# Altium schematic sheet DisplayPort.SchDoc
size A3
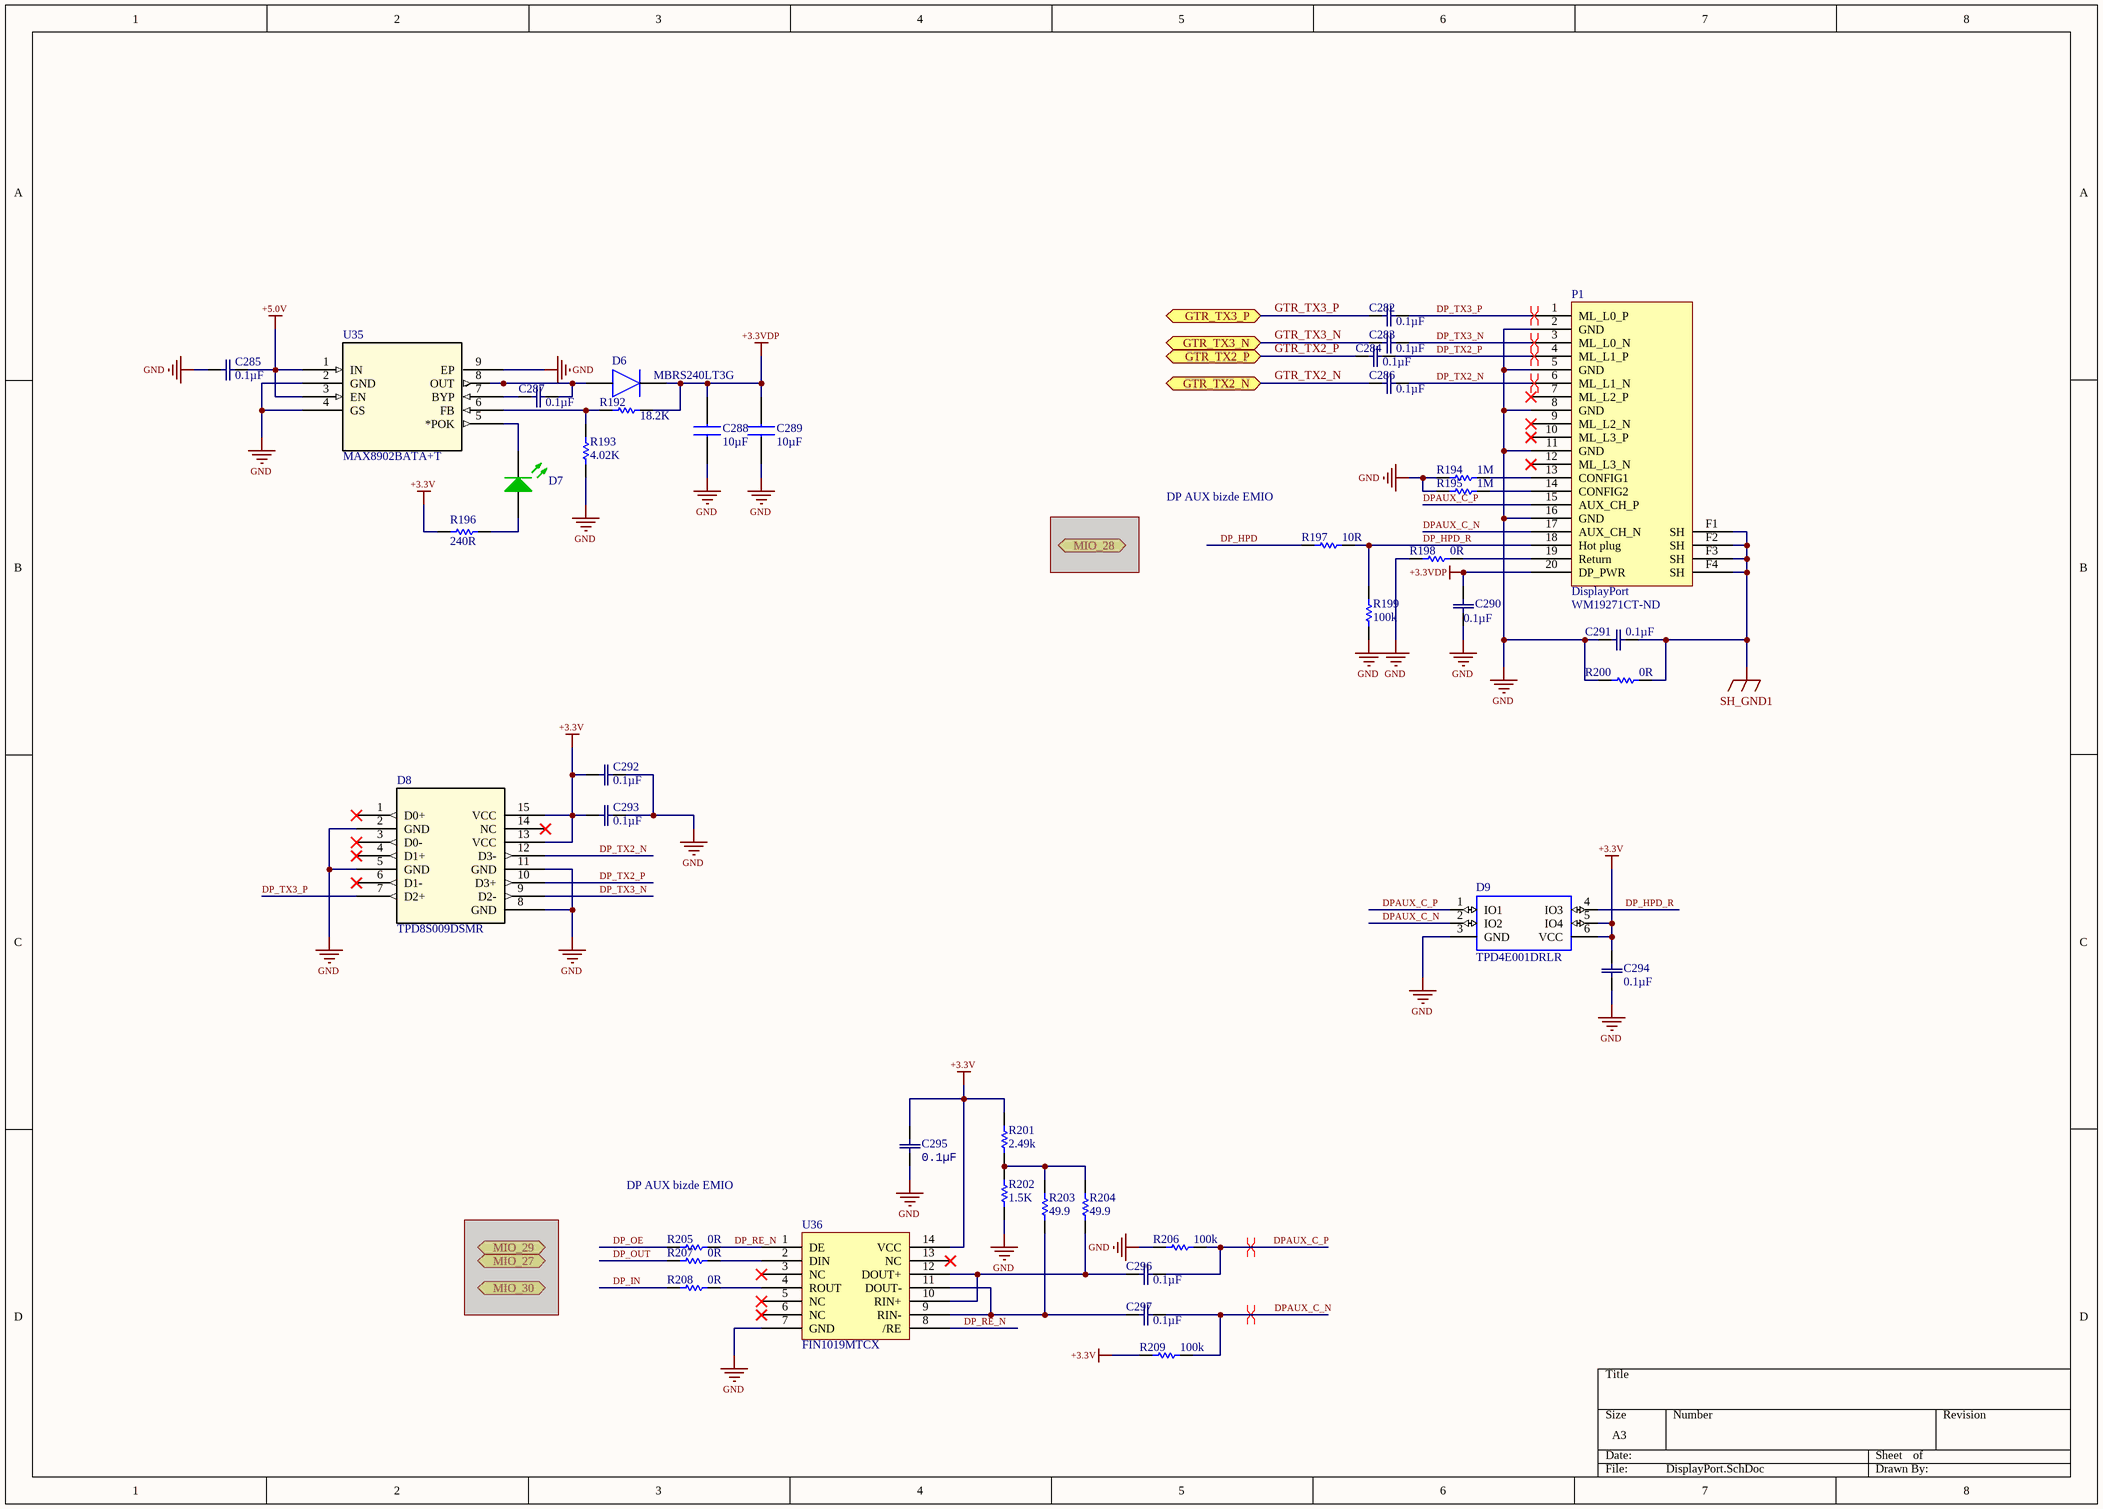
[diagram p0: DisplayPort.SchDoc]

## Parts
C282  value 0.1µF  [CAP_0603]  (hidden comment: C0603X5R1E104K030BB)
C283  value 0.1µF  [CAP_0603]  (hidden comment: C0603X5R1E104K030BB)
C284  value 0.1µF  [CAP_0603]  (hidden comment: C0603X5R1E104K030BB)
C285  value 0.1µF  [CAP_0603]  (hidden comment: C0603X5R1E104K030BB)
C286  value 0.1µF  [CAP_0603]  (hidden comment: C0603X5R1E104K030BB)
C287  value 0.1µF  [CAP_0603]  (hidden comment: C0603X5R1E104K030BB)
C288  value 10µF  [CAP 0402ZD106]  (hidden comment: 0402ZD106MAT2A)
C289  value 10µF  [CAP 0402ZD106]  (hidden comment: 0402ZD106MAT2A)
C290  value 0.1µF  [CAP_0603]  (hidden comment: C0603X5R1E104K030BB)
C291  value 0.1µF  [CAP_0603]  (hidden comment: C0603X5R1E104K030BB)
C292  value 0.1µF  [CAP_0603]  (hidden comment: C0603X5R1E104K030BB)
C293  value 0.1µF  [CAP_0603]  (hidden comment: C0603X5R1E104K030BB)
C294  value 0.1µF  [CAP_0603]  (hidden comment: C0603X5R1E104K030BB)
C295  value 0.1µF  [CAP_0603]  (hidden comment: C0603X5R1E104K030BB)
C296  value 0.1µF  [CAP_0603]  (hidden comment: C0603X5R1E104K030BB)
C297  value 0.1µF  [CAP_0603]  (hidden comment: C0603X5R1E104K030BB)
D6  MBRS240LT3G  [DIOM5436X247N]
D7  LED0603GREEN  [LED0603GREEN]  (value not drawn)
D8  TPD8S009DSMR  [DSM15]
D9  TPD4E001DRLR  [SOTFL50P160X60-6N]
P1  DisplayPort  Supplier Part Number 1: WM19271CT-ND  [8470-2-2-X]
R192  value 18.2K  [RES_CRCW_0402]  (hidden comment: RES0402_18K2)
R193  value 4.02K  [RC0402N]  (hidden comment: RES0402_4K02)
R194  value 1M  [RESC1005L_0402]  (hidden comment: RES0402_1M)
R195  value 1M  [RESC1005L_0402]  (hidden comment: RES0402_1M)
R196  value 240R  [RESC1005L_0402]  (hidden comment: RES0402_240R_0W1_1T)
R197  value 10R  [RESC1005L_0402]  (hidden comment: RES0402_10R)
R198  value 0R  [RESC1005L_0402]  (hidden comment: RES0402_0R)
R199  value 100k  [RESC1005L_0402]  (hidden comment: RES0402_100K_0W2_1T)
R200  value 0R  [RESC1005L_0402]  (hidden comment: RES0402_0R_0W1)
R201  value 2.49k  [RESC1005L_0402]  (hidden comment: RES0402_2K49_0W1_1T)
R202  value 1.5K  [RESC1005L_0402]  (hidden comment: RES0402_1K5)
R203  value 49.9  [RESC1005L_0402]  (hidden comment: RES0402_49.9)
R204  value 49.9  [RESC1005L_0402]  (hidden comment: RES0402_49.9)
R205  value 0R  [RESC1005L_0402]  (hidden comment: RES0402_0R)
R206  value 100k  [RESC1005L_0402]  (hidden comment: RES0402_100K_0W2_1T)
R207  value 0R  [RESC1005L_0402]  (hidden comment: RES0402_0R)
R208  value 0R  [RESC1005L_0402]  (hidden comment: RES0402_0R)
R209  value 100k  [RESC1005L_0402]  (hidden comment: RES0402_100K_0W2_1T)
U35  MAX8902BATA+T  [21-0168E_T822-1]
U36  FIN1019MTCX  [TSOP65P640X120-14N]

## Ports
GTR_TX2_N, GTR_TX2_P, GTR_TX3_N, GTR_TX3_P, MIO_27, MIO_28, MIO_29, MIO_30

## Nets
+3.3V: C292.2 C293.2 C294.2 C295.2 D8.13(VCC) D8.15(VCC) D9.5(IO4) D9.6(VCC) R196.1 R201.2 R209.1 U36.14(VCC)
+3.3VDP: C288.2 C289.2 C290.2 D6.1(K) P1.20(DP_PWR) R192.2
+5.0V: C285.2 U35.1(IN) U35.3(EN)
GND: C285.1 C288.1 C289.1 C290.1 C291.1 C292.1 C293.1 C294.1 C295.1 D8.2(GND) D8.5(GND) D8.8(GND) D8.11(GND) D9.3(GND) P1.2(GND) P1.5(GND) P1.8(GND) P1.11(GND) P1.16(GND) R193.1 R194.1 R195.1 R198.1 R199.1 R200.1 R202.1 R206.1 U35.2(GND) U35.4(GS) U35.9(EP) U36.7(GND)
SH_GND1: C291.2 P1.F1(SH) P1.F2(SH) P1.F3(SH) P1.F4(SH) R200.2
DP_HPD: R197.1
DP_HPD_R: D9.4(IO3) P1.18(Hot_plug) R197.2 R199.2
DP_IN: R208.1
DP_OE: R205.1
DP_OUT: R207.1
DP_RE_N: R205.2 U36.1(DE) U36.8(/RE)
DP_TX2_N: C286.2 D8.12(D3-) P1.6(ML_L1_N)
DP_TX2_P: C284.2 D8.10(D3+) P1.4(ML_L1_P)
DP_TX3_N: C283.2 D8.9(D2-) P1.3(ML_L0_N)
DP_TX3_P: C282.2 D8.7(D2+) P1.1(ML_L0_P)
DPAUX_C_N: C297.2 D9.2(IO2) P1.17(AUX_CH_N) R209.2
DPAUX_C_P: C296.2 D9.1(IO1) P1.15(AUX_CH_P) R206.2
GTR_TX2_N: C286.1 ; port GTR_TX2_N
GTR_TX2_P: C284.1 ; port GTR_TX2_P
GTR_TX3_N: C283.1 ; port GTR_TX3_N
GTR_TX3_P: C282.1 ; port GTR_TX3_P
NetC287_1: C287.1 U35.7(BYP)
NetC287_2: C287.2 D6.2(A) U35.8(OUT)
NetC296_1: C296.1 R204.1 U36.10(RIN+) U36.12(DOUT+)
NetC297_1: C297.1 R203.1 U36.9(RIN-) U36.11(DOUT-)
NetD7_1: D7.1(A) R196.2
NetD7_2: D7.2(K) U35.5(*POK)
NetP1_13: P1.13(CONFIG1) R194.2
NetP1_14: P1.14(CONFIG2) R195.2
NetP1_19: P1.19(Return) R198.2
NetR192_1: R192.1 R193.2 U35.6(FB)
NetR201_1: R201.1 R202.2 R203.2 R204.2
NetR207_2: R207.2 U36.2(DIN)
NetR208_2: R208.2 U36.4(ROUT)

Not connected (* = marked no-connect by the designer): D8 1(D0+)* 3(D0-)* 4(D1+)* 6(D1-)* 14(NC)*; P1 7(ML_L2_P)* 9(ML_L2_N)* 10(ML_L3_P)* 12(ML_L3_N)*; U36 3(NC)* 5(NC)* 6(NC)* 13(NC)*

## Layout directives
differential pair: DP_TX2_N, DP_TX2_P, DP_TX3_N, DP_TX3_P, DPAUX_C_N, DPAUX_C_P

## Notes on the sheet
- DP AUX bizde EMIO

## Library data of the parts
C282-C287 C290-C297 = C0603X5R1E104K030BB: CAP CER 0.1UF 25V 10% X5R 0201; Manufacturer: TDK Corporation; Detailed Description: 0.1µF ±10% 25V Ceramic Capacitor X5R 0201 (0603 Metric); Manufacturer_Part_Number: C0603X5R1E104K030BB; Digi-Key Part Number: 445-13671-1-ND; Tolerance: ±10%; Voltage - Rated: 25V; Temperature Coefficient: X5R; Operating Temperature: -55°C ~ 85°C; Features: Low ESL; Applications: General Purpose; Mounting Type: Surface Mount, MLCC; Supplier 1: Digi-Key; Supplier Part Number 1: 445-13671-1-ND
C288 C289 = CAP 0402ZD106: CAP CER 10UF 10V X5R 0402; Manufacturer_Name: AVX; Geometry.Height: 0.56mm; Detailed Description: 10µF ±20% 10V Ceramic Capacitor X5R 0402 (1005 Metric); Tolerance: ±20%; Manufacturer_Part_Number: 0402ZD106MAT2A; Datasheet Link: http://www.mouser.com/catalog/supplier/library/pdf/AVXSurfaceMountCeramic.pdf; Digi-Key Part Number: 478-10052-1-ND; Voltage - Rated: 10V; Temperature Coefficient: X5R; Operating Temperature: -55°C ~ 85°C; Mounting Type: Surface Mount, MLCC; Supplier 1: Digi-Key; Supplier Part Number 1: 478-10052-2-ND
D6 = D MBRS240LT3G: DIODE SCHOTTKY 40V 2A SMB; Manufacturer_Name: ON Semiconductor; Allied_Number: 70099506; Geometry.Height: 2.47mm; Supplier_Name: RS; RS Part Number: 1022262; Manufacturer_Part_Number: MBRS240LT3G; Other Part Number: *; Datasheet Link: http://www.onsemi.com/pub/Collateral/MBRS240LT3-D.PDF; 3D Package: *; Supplier 1: Digi-Key; Supplier Part Number 1: MBRS240LT3GOSCT-ND
D7 = LED0603GREEN: LED GREEN DIFFUSED 0603 SMD; Manufacturer 1: Broadcom Limited; Manufacturer Part Number 1: HSMM-C190; Voltage - Forward (Vf) (Typ): 3.3V; Current - Test: 20mA; Package: 0603; Supplier 1: Digi-Key; Supplier Part Number 1: 516-2833-1-ND; ComponentLink1Description: Datasheet; ComponentLink1URL: C:\Users\Public\Documents\Altium\AD16\Library\PDF\AV02-0592EN0.pdf
D8 = TPD8S009DSMR: TVS DIODE 5.5VWM 15SON; Vendor: Texas Instruments; Section: Power Management; C: Copyright (C) 2015 Accelerated Designs. All rights reserved; Manufacturer_Part_Number: TPD8S009DSMR; Family: Power Misc; Manufacturer_Name: Texas Instruments; Copyright: Copyright (C) 2015 Accelerated Designs. All rights reserved; RS_Part_Number: 7099082; Value: Value; Type: Type; RefDes: RefDes; Supplier 1: Digi-Key; Supplier Part Number 1: 296-23829-1-ND
D9 = D TPD4E001DRLR: Low-Capacitance 4-Channel +/-15-kV ESD Protection Array for High-Speed Data Interfaces; Manufacturer_Name: Texas Instruments; Geometry.Height: 0.6mm; Type: Steering; Unidirectional Channels: 4; Voltage - Reverse Standoff (Typ): 5.5V (Max); Voltage - Breakdown (Min): 11V; Power - Peak Pulse: 100W; Power Line Protection: Yes; Manufacturer_Part_Number: TPD4E001DRLR; Datasheet Link: http://www.ti.com/lit/ds/symlink/tpd4e001.pdf; Digi-Key Part Number: 296-21887-1-ND; Applications: Ethernet; Operating Temperature: -40°C ~ 85°C (TA); Mounting Type: Surface Mount; Package / Case: SOT-563, SOT-666; Supplier Device Package: 6-SOT; Supplier 1: Digi-Key; Supplier Part Number 1: 296-21887-1-ND
P1 = DisplayPort: CONN RCPT 20POS UDI R/A SMD; Manufacturer: Molex, LLC; Manufacturer Part Number: 0472720001; Detailed Description: DisplayPort Receptacle Connector 20 Position Surface Mount, Right Angle; Through Hole; Number of Contacts: 20; Gender: Receptacle; Number of Ports: 1; Current Rating: 0.5A; Voltage - Rated: 40VAC; Mating Cycles: 10000; Shielding: Shielded; Material Flammability Rating: UL94 V-0; Digi-Key Part Number: WM19271CT-ND; Series: 47272; Connector Type: DisplayPort; Specifications: -; Mounting Type: Surface Mount, Right Angle; Through Hole; Mounting Feature: Horizontal; Termination: Solder; Features: Board Guide, Latch Lock; Ingress Protection: -; Operating Temperature: -20°C ~ 85°C; Contact Finish: Gold; Shell/Shielding Material: Steel, Stainless; Insulation Color: Black; Supplier 1: Digi-Key
R192 = RES0402_18K2: RES SMD 18.2K OHM 1% 1/16W 0402; Manufacturer_Part_Number: CRCW040218K2FKED; Vendor: Vishay; Supersection: Passives; Section: Resistors; C: Copyright (C) 2015 Accelerated Designs. All rights reserved; Family: Surface Mount, Fixed; Manufacturer_Name: Vishay; Copyright: Copyright (C) 2015 Accelerated Designs. All rights reserved; RS_Part_Number: 6784684; Supplier 1: Digi-Key
R193 = RES0402_4K02: RES SMD 4.02K OHM 1% 1/16W 0402; Manufacturer_Part_Number: CRCW04024K02FKED; Vendor: Vishay; Resistance_In_Ohms: 0.0; Power_(Watts): 0.063W, 1/16W; Tolerance: Jumper; Lead_Style: Surface Mount (SMD - SMT); Voltage_-_Working: 50V; Number_of_Terminations: 2; C: Copyright (C) 2015 Accelerated Designs. All rights reserved; DigiKeyPartNumber: 541-0.0JTR-ND; Quantity_Available: 3480000; Copyright: Copyright (C) 2015 Accelerated Designs. All rights reserved; DataSheet: http://www.vishay.com/docs/20035/dcrcwe3.pdf; Case: 0402 (1005 metric); Packaging: Tape &amp; Reel (TR); Composition: Thick Film; Temperature_Coefficient: -; Resistance_(Ohms): 0.0; Features: -; Package_/_Case: 0402 (1005 Metric); Size_/_Dimension: 0.039" L x 0.020" W (1.00mm x 0.50mm); Height: 0.016" (0.40mm)
R194 R195 = RES0402_1M: RES SMD 1M OHM 1% 1/16W 0402; Manufacturer: Vishay Dale; Manufacturer Part Number: CRCW04021M00FKED; Power: 0.063W, 1/16W; Package: 0402; ComponentLink1Description: Datasheet; Tolerance: 1%; Supplier 1: Digi-Key; Supplier Part Number 1: 311-1.00MLRCT-ND
R196 = RES0402_240R_0W1_1T: RES SMD 240 OHM 1% 1/10W 0402; Manufacturer 1: Panasonic Electronic Components; Manufacturer Part Number 1: ERJ-2RKF2400X; Package: 0402; ComponentLink1Description: Datasheet; Power: 1/10W; Tolerance: 1%; Supplier 1: Digi-Key; Supplier Part Number 1: P240LCT-ND
R197 = RES0402_10R: RES SMD 10 OHM 1% 1/16W 0402; Manufacturer 1: Vishay Dale; Manufacturer Part Number 1: CRCW040210R0FKED; Power: 0.063W, 1/16W; Package: 0402; ComponentLink1Description: Datasheet; Tolerance: -; Supplier 1: Digi-Key; Supplier Part Number 1: 541-10.0YCT-ND
R198 R205 R207 R208 = RES0402_0R: RES SMD 0 OHM JUMPER 1/16W 0402; Manufacturer 1: Vishay Dale; Manufacturer Part Number 1: CRCW04020000Z0ED; Power: 0.063W, 1/16W; Package: 0402; ComponentLink1Description: Datasheet; Tolerance: -; Supplier 1: Digi-Key; Supplier Part Number 1: 541-0.0JCT-ND
R199 R206 R209 = RES0402_100K_0W2_1T: RES SMD 100K OHM 1% 1/5W 0402; Manufacturer 1: Vishay Dale; Manufacturer Part Number 1: RCS0402100KFKED; Package: 0402; ComponentLink1Description: Datasheet; Power: 1/5W; Tolerance: 1%; Supplier 1: Digi-Key; Supplier Part Number 1: 541-2899-1-ND
R200 = RES0402_0R_0W1: RES SMD 0 OHM JUMPER 1/10W 0402; Manufacturer 1: Panasonic Electronic Components; Manufacturer Part Number 1: ERJ-2GE0R00X; Package: 0402; ComponentLink1Description: Datasheet; Power: 1/10W; Tolerance: -; Supplier 1: Digi-Key; Supplier Part Number 1: P0.0JCT-ND
R201 = RES0402_2K49_0W1_1T: RES SMD 2.49K OHM 1% 1/10W 0402; Manufacturer 1: Panasonic Electronic Components; Manufacturer Part Number 1: ERJ-2RKF2491X; Package: 0402; ComponentLink1Description: Datasheet; Power: 1/10W; Tolerance: 1%; Supplier 1: Digi-Key; Supplier Part Number 1: P2.49KLCT-ND
R202 = RES0402_1K5: RES SMD 1.5K OHM 1% 1/16W 0402; Manufacturer 1: Vishay Dale; Manufacturer Part Number 1: CRCW04021K50FKED; Power: 1/10W; Package: 0402; ComponentLink1Description: Datasheet; Tolerance: 1%; Supplier 1: Digi-Key
R203 R204 = RES0402_49.9: RES SMD 49.9 OHM 1% 1/16W 0402; Manufacturer: Vishay Dale; Manufacturer Part Number: CRCW040249R9FKED; Power: 0.063W, 1/16W; Package: 0402; ComponentLink1Description: Datasheet; Tolerance: 1%; Supplier 1: Digi-Key; Supplier Part Number 1: 311-49.9LRCT-ND
U35 = MAX8902BATA+T: IC REG LDO ADJ 0.5A 8TDFN; Vendor: Maxim Integrated Products; C: Copyright (C) 2015 Accelerated Designs. All rights reserved; Manufacturer_Part_Number: MAX8902BATA+T; Copyright: Copyright (C) 2015 Accelerated Designs. All rights reserved; Value: Value; Type: Type; RefDes: RefDes; Supplier 1: Digi-Key; Supplier Part Number 1: MAX8902BATA+TCT-ND
U36 = FIN1019MTCX: IC DRVR/RCVR3.3V LVDS HS 14TSSOP; Manufacturer: Fairchild/ON Semiconductor; Detailed Description: 1/1 Transceiver Full LVDS 14-TSSOP; Number of Drivers/Receivers: 1/1; Duplex: Full; Voltage - Supply: 3 V ~ 3.6 V; Data Rate: 400Mbps; Digi-Key Part Number: FIN1019MTCXCT-ND; Manufacturer Part Number: FIN1019MTCX; Type: Transceiver; Protocol: LVDS; Supplier Device Package: 14-TSSOP; Mounting Type: Surface Mount; Package / Case: 14-TSSOP (0.173", 4.40mm Width); Supplier 1: Digi-Key; Supplier Part Number 1: FIN1019MTCXCT-ND